# Altium project MATRIX_CLOCK.PrjPcb
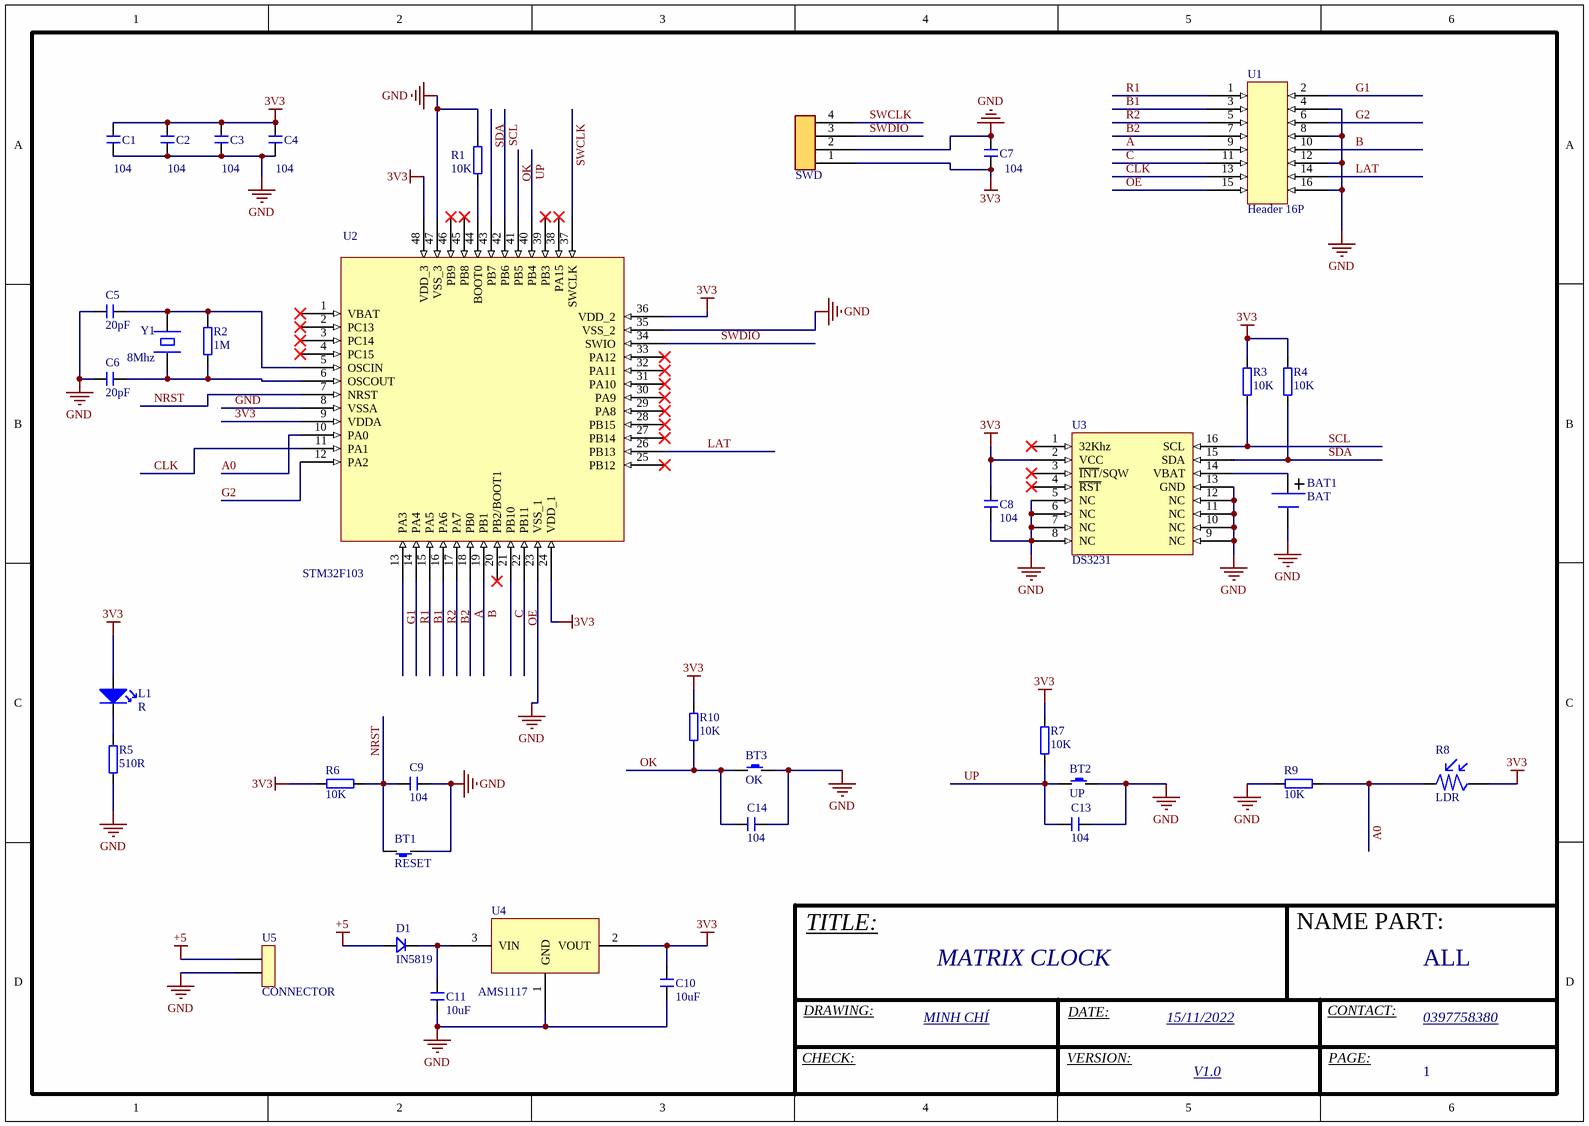
[diagram p0: MATRIX_CLOCK.SchDoc]
1 sheet, 36 parts. Net scope: global (net labels, ports and power ports of the same name join across sheets).
Board file: MATRIX_CLOCK.PcbDoc

## Sheet MATRIX_CLOCK.SchDoc
size 297 x 209 mm; SheetNumber: 1; SheetTotal: 1

### Parts
BAT1  BAT  [CR11220]
BT1  RESET  [BUTTON-2P-SMD]
BT2  UP  [BUTTON-2P-SMD]
BT3  OK  [BUTTON-2P-SMD]
C1  104  [CAP-0805]
C2  104  [CAP-0805]
C3  104  [CAP-0805]
C4  104  [CAP-0805]
C5  20pF  [CAP-0805]
C6  20pF  [CAP-0805]
C7  104  [CAP-0805]
C8  104  [CAP-0805]
C9  104  [CAP-0805]
C10  10uF  [CAP-0805]
C11  10uF  [CAP-0805]
C13  104  [CAP-0805]
C14  104  [CAP-0805]
D1  IN5819  [IN5819]
L1  R  [LED-R]
R1  10K  [RES-0805]
R2  1M  [RES-0805]
R3  10K  [RES-0805]
R4  10K  [RES-0805]
R5  510R  [RES-0805]
R6  10K  [RES-0805]
R7  10K  [RES-0805]
R8  LDR  [LDR2]
R9  10K  [RES-0805]
R10  10K  [RES-0805]
SWD  HEADER-4P  [HEADER-4P]  (value not drawn)
U1  Header 16P  [HEADER16P]
U2  STM32F103  [LQFP-48]
U3  DS3231  [SOIC16-W]
U4  AMS1117  [SOT-223]
U5  CONNECTOR  [XH-2P]
Y1  8Mhz  [QUARTZ]

### Nets
3V3: C1.1 C2.1 C3.1 C4.1 C7.2 C8.1 C10.1 L1.1 R3.2 R4.2 R6.1 R7.1 R8.1 R10.1 SWD.1 U2.9(VDDA) U2.24(VDD_1) U2.36(VDD_2) U2.48(VDD_3) U3.2(VCC) U4.2(VOUT)
+5: D1.1(A) U5.1
GND: BAT1.2 BT1.1 BT2.2 BT3.2 C1.2 C2.2 C3.2 C4.2 C5.2 C6.2 C7.1 C8.2 C9.2 C10.2 C11.2 C13.2 C14.2 R1.1 R5.1 R9.1 SWD.2 U1.4 U1.8 U1.12 U1.16 U2.8(VSSA) U2.23(VSS_1) U2.35(VSS_2) U2.47(VSS_3) U3.5(NC) U3.6(NC) U3.7(NC) U3.8(NC) U3.9(NC) U3.10(NC) U3.11(NC) U3.12(NC) U3.13(GND) U4.1(GND) U5.2
A: U1.9 U2.18(PB0)
A0: R8.1 R9.2 U2.10(PA0)
B: U1.10 U2.19(PB1)
B1: U1.3 U2.15(PA5)
B2: U1.7 U2.17(PA7)
C: U1.11 U2.21(PB10)
CLK: U1.13 U2.11(PA1)
G1: U1.2 U2.13(PA3)
G2: U1.6 U2.12(PA2)
LAT: U1.14 U2.26(PB13)
NRST: BT1.2 C9.1 R6.2 U2.7(NRST)
OE: U1.15 U2.22(PB11)
OK: BT3.1 C14.1 R10.2 U2.41(PB5)
R1: U1.1 U2.14(PA4)
R2: U1.5 U2.16(PA6)
SCL: R3.1 U2.42(PB6) U3.16(SCL)
SDA: R4.1 U2.43(PB7) U3.15(SDA)
SWCLK: SWD.4 U2.37(SWCLK)
SWDIO: SWD.3 U2.34(SWIO)
UP: BT2.1 C13.1 R7.2 U2.40(PB4)
NetBAT1_1: BAT1.1 U3.14(VBAT)
NetC5_1: C5.1 R2.2 U2.5(OSCIN) Y1.2
NetC6_1: C6.1 R2.1 U2.6(OSCOUT) Y1.1
NetC11_1: C11.1 D1.2(K) U4.3(VIN)
NetL1_2: L1.2 R5.2
NetR1_2: R1.2 U2.44(BOOT0)

Not connected (* = marked no-connect by the designer): U2 1(VBAT)* 2(PC13)* 3(PC14)* 4(PC15)* 20(PB2/BOOT1)* 25(PB12)* 27(PB14)* 28(PB15)* 29(PA8)* 30(PA9)* 31(PA10)* 32(PA11)* 33(PA12)* 38(PA15)* 39(PB3)* 45(PB8)* 46(PB9)*; U3 1(32Khz)* 3(~{INT}/SQW)* 4(~{RST})*

### Notes on the sheet
- MATRIX CLOCK
- ALL
- MINH CHÍ
- 15/11/2022
- V1.0
- 1
- 0397758380
- TITLE:
- NAME PART:
- DRAWING:
- CONTACT:
- CHECK:
- VERSION:
- DATE:
- PAGE:

### Library data of the parts
BAT1 = BAT_CR1220
BT1-BT3 = BUTON-2P
C1-C11 C13 C14 = CAP-NON
D1 = DIODE
L1 = LED-SINGLE
R1-R7 R9 R10 = RES
U1 = CONNECTOR 16P
U2 = STM32F103_MCU
U4 = AMS1117_SOT-232
U5 = XH-2P
Y1 = Quartz